# Altium schematic sheet DMP_SEM_SDCARD.SchDoc: Target MCU
size A3; Organization: Microchip; Address1: Vestre Rosten 79; Address2: N-7075 TILLER; Address3: NORWAY; DocumentNumber: A09-2748; Revision: 11; SheetNumber: 4; SheetTotal: 4; DrawnBy: Microchip Norway; Engineer: HN; PageSetup: Record=PageOptions|CenterHorizontal=True|CenterVertical=True|PrintScale=1.01|XCorrection=1.00|YCorrection=1.00|PrintKind=1|BorderSize=5000000|LeftOffset=0|BottomOffset=0|Orientation=2|PaperLength=1000|PaperWidth=1000|Scale=100|PaperSource=7|PrintQuality=-4|MediaType=1|DitherType=10|PaperKind=A3 (297 x 420 mm)|PrintScaleMode=1; ProjectTitle: SAM E54 Xplained Pro; PCBNumber: A08-2643; PCBRevision: 4; ProjectName: SAM E54 Xplained Pro
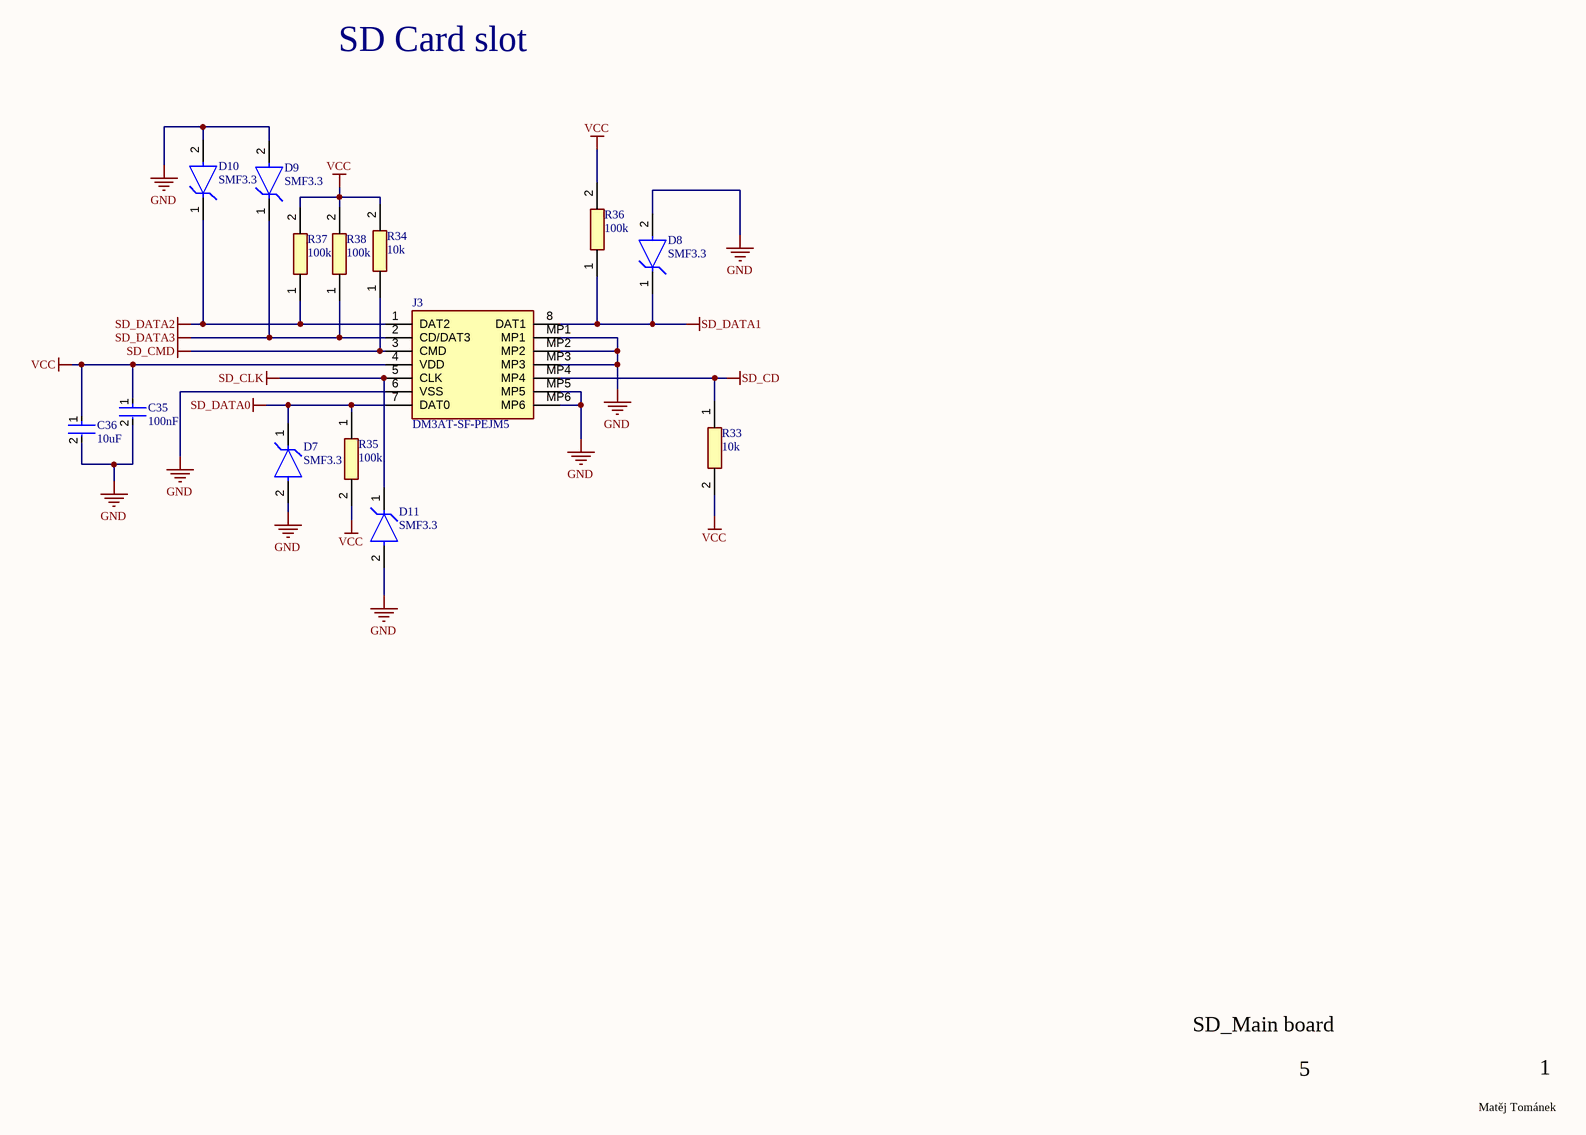
[diagram p0: DMP_SEM_SDCARD.SchDoc]

## Parts
C35  100nF  [CL05B104KO5NNNC]
C36  10uF  [CL10A106KO8NQNC]
D7  SMF3.3  [SMF3.3]
D8  SMF3.3  [SMF3.3]
D9  SMF3.3  [SMF3.3]
D10  SMF3.3  [SMF3.3]
D11  SMF3.3  [SMF3.3]
J3  DM3AT-SF-PEJM5  [DM3ATSFPEJM5]
R33  10k  [CRCW060310K0FKEA]
R34  10k  [CRCW060310K0FKEA]
R35  100k  [ERJ-2RKF1003X]
R36  100k  [ERJ-2RKF1003X]
R37  100k  [ERJ-2RKF1003X]
R38  100k  [ERJ-2RKF1003X]

## Nets
GND: C35.2 C36.2 D7.2(A) D8.2(A) D9.2(A) D10.2(A) D11.2(A) J3.6(VSS) J3.MP1 J3.MP2 J3.MP3 J3.MP5 J3.MP6
SD_CD: J3.MP4 R33.1
SD_CLK: D11.1(C) J3.5(CLK)
SD_CMD: J3.3(CMD) R34.1
SD_DATA0: D7.1(C) J3.7(DAT0) R35.1
SD_DATA1: D8.1(C) J3.8(DAT1) R36.1
SD_DATA2: D10.1(C) J3.1(DAT2) R37.1
SD_DATA3: D9.1(C) J3.2(CD/DAT3) R38.1
VCC: C35.1 C36.1 J3.4(VDD) R33.2 R34.2 R35.2 R36.2 R37.2 R38.2

## Notes on the sheet
- SD Card slot
- SD_Main board
- 5
- 1
- Matěj Tománek
- DWG. NO.
- REV.
- SHT.
- THIS DOCUMENT AND THE DATA DISCLOSED HEREIN OR HEREWITH IS THE PROPERTY OF ALTIUM LIMITED AND MAY BE FREELY DISTRIBUTED IN WHOLE. NO RIGHTS ARE RESERVED OR EXPRESS OR IMPLIED WARANTEE GIVEN.
- REVISION
- DESCRIPTION
- DATE
- APPROVED
- ENG:
- APPROVALS
- PROJECT
- DSN:
- CHK:
- REFERENCE DOCUMENTS
- PROJECT REVISION:
- TITLE
- DOCUMENT REVISION:
- DESIGN ITEM:
- BOM:
- FAB DWG:
- PCB DWG:
- ASSY DWG:
- SCALE:
- SIZE
- B
- CAGE CODE
- FILE NAME
- DWG NO.
- SHEET
- OF
- REV

## Library data of the parts
C35 = CL05B104KO5NNNC: Capacitor CL05B104KO5NNNC
C36 = CL10A106KO8NQNC: Capacitor CL10A106KO8NQNC
D7-D11 = SMF3.3: TVS diode SMF3.3
J3 = DM3AT-SF-PEJM5: Connector; Manufacturer_Name: Hirose; Datasheet Link: https://datasheet.lcsc.com/szlcsc/Hirose-HRS-DM3AT-SF-PEJM5_C114218.pdf; Height: 1.83mm; Manufacturer_Part_Number: DM3AT-SF-PEJM5; Mouser Part Number: 798-DM3AT-SF-PEJM5; Mouser Price/Stock: https://www.mouser.co.uk/ProductDetail/Hirose-Connector/DM3AT-SF-PEJM5?qs=LZSZKJVF%252B2WTDKp%252BR7IYAQ%3D%3D
R33 R34 = CRCW060310K0FKEA: Resistor CRCW060310K0FKEA
R35-R38 = ERJ-2RKF1003X: Resistor